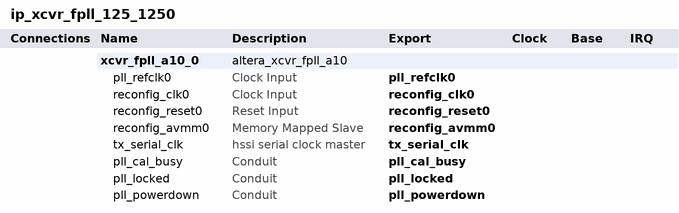
[diagram p0: system contents]
# Platform Designer (Qsys) system ip_xcvr_fpll_125_1250, Arria 10 10AX115N2F45E1SG
# Parameters at their usual value, and those the tool derives, are not listed.
package require -exact qsys 18.1
create_system ip_xcvr_fpll_125_1250
set_project_property DEVICE_FAMILY {Arria 10}
set_project_property DEVICE 10AX115N2F45E1SG

add_instance xcvr_fpll_a10_0 altera_xcvr_fpll_a10 18.1
set_instance_property xcvr_fpll_a10_0 AUTO_EXPORT true
set_instance_parameter_value xcvr_fpll_a10_0 base_device NIGHTFURY5
set_instance_parameter_value xcvr_fpll_a10_0 enable_analog_resets 0
set_instance_parameter_value xcvr_fpll_a10_0 enable_bonding_clks 0
set_instance_parameter_value xcvr_fpll_a10_0 enable_ext_lockdetect_ports 0
set_instance_parameter_value xcvr_fpll_a10_0 enable_fb_comp_bonding 0
set_instance_parameter_value xcvr_fpll_a10_0 enable_hfreq_clk 0
set_instance_parameter_value xcvr_fpll_a10_0 enable_mcgb 0
set_instance_parameter_value xcvr_fpll_a10_0 enable_mcgb_pcie_clksw 0
set_instance_parameter_value xcvr_fpll_a10_0 enable_pld_mcgb_cal_busy_port 0
set_instance_parameter_value xcvr_fpll_a10_0 enable_pll_reconfig 1
set_instance_parameter_value xcvr_fpll_a10_0 generate_add_hdl_instance_example 0
set_instance_parameter_value xcvr_fpll_a10_0 generate_docs 0
set_instance_parameter_value xcvr_fpll_a10_0 gui_actual_outclk0_frequency 100.0
set_instance_parameter_value xcvr_fpll_a10_0 gui_actual_outclk1_frequency 100.0
set_instance_parameter_value xcvr_fpll_a10_0 gui_actual_outclk2_frequency 100.0
set_instance_parameter_value xcvr_fpll_a10_0 gui_actual_outclk3_frequency 100.0
set_instance_parameter_value xcvr_fpll_a10_0 gui_actual_refclk_frequency 125.0
set_instance_parameter_value xcvr_fpll_a10_0 gui_bw_sel high
set_instance_parameter_value xcvr_fpll_a10_0 gui_cascade_outclk_index 0
set_instance_parameter_value xcvr_fpll_a10_0 gui_desired_hssi_cascade_frequency 100.0
set_instance_parameter_value xcvr_fpll_a10_0 gui_desired_outclk0_frequency 100.0
set_instance_parameter_value xcvr_fpll_a10_0 gui_desired_outclk1_frequency 100.0
set_instance_parameter_value xcvr_fpll_a10_0 gui_desired_outclk2_frequency 100.0
set_instance_parameter_value xcvr_fpll_a10_0 gui_desired_outclk3_frequency 100.0
set_instance_parameter_value xcvr_fpll_a10_0 gui_desired_refclk_frequency 125.0
set_instance_parameter_value xcvr_fpll_a10_0 gui_enable_50G_support false
set_instance_parameter_value xcvr_fpll_a10_0 gui_enable_active_clk false
set_instance_parameter_value xcvr_fpll_a10_0 gui_enable_cascade_out false
set_instance_parameter_value xcvr_fpll_a10_0 gui_enable_clk_bad false
set_instance_parameter_value xcvr_fpll_a10_0 gui_enable_dps false
set_instance_parameter_value xcvr_fpll_a10_0 gui_enable_fractional false
set_instance_parameter_value xcvr_fpll_a10_0 gui_enable_hip_cal_done_port 0
set_instance_parameter_value xcvr_fpll_a10_0 gui_enable_manual_config false
set_instance_parameter_value xcvr_fpll_a10_0 gui_enable_manual_hssi_counters false
set_instance_parameter_value xcvr_fpll_a10_0 gui_enable_phase_alignment false
set_instance_parameter_value xcvr_fpll_a10_0 gui_enable_pld_cal_busy_port 1
set_instance_parameter_value xcvr_fpll_a10_0 gui_fpll_mode 2
set_instance_parameter_value xcvr_fpll_a10_0 gui_fractional_x 32
set_instance_parameter_value xcvr_fpll_a10_0 gui_hip_cal_en 0
set_instance_parameter_value xcvr_fpll_a10_0 gui_hssi_output_clock_frequency 625.0
set_instance_parameter_value xcvr_fpll_a10_0 gui_hssi_prot_mode 0
set_instance_parameter_value xcvr_fpll_a10_0 gui_iqtxrxclk_outclk_index 0
set_instance_parameter_value xcvr_fpll_a10_0 gui_is_downstream_cascaded_pll false
set_instance_parameter_value xcvr_fpll_a10_0 gui_number_of_output_clocks 1
set_instance_parameter_value xcvr_fpll_a10_0 gui_operation_mode 0
set_instance_parameter_value xcvr_fpll_a10_0 gui_outclk0_actual_phase_shift 0.0
set_instance_parameter_value xcvr_fpll_a10_0 gui_outclk0_actual_phase_shift_deg 0.0
set_instance_parameter_value xcvr_fpll_a10_0 gui_outclk0_desired_phase_shift 0.0
set_instance_parameter_value xcvr_fpll_a10_0 gui_outclk0_phase_shift_unit 0
set_instance_parameter_value xcvr_fpll_a10_0 gui_outclk1_actual_phase_shift 0.0
set_instance_parameter_value xcvr_fpll_a10_0 gui_outclk1_actual_phase_shift_deg 0.0
set_instance_parameter_value xcvr_fpll_a10_0 gui_outclk1_desired_phase_shift 0
set_instance_parameter_value xcvr_fpll_a10_0 gui_outclk1_phase_shift_unit 0
set_instance_parameter_value xcvr_fpll_a10_0 gui_outclk2_actual_phase_shift {0 ps}
set_instance_parameter_value xcvr_fpll_a10_0 gui_outclk2_actual_phase_shift_deg {0 deg}
set_instance_parameter_value xcvr_fpll_a10_0 gui_outclk2_desired_phase_shift 0
set_instance_parameter_value xcvr_fpll_a10_0 gui_outclk2_phase_shift_unit 0
set_instance_parameter_value xcvr_fpll_a10_0 gui_outclk3_actual_phase_shift 0.0
set_instance_parameter_value xcvr_fpll_a10_0 gui_outclk3_actual_phase_shift_deg 0.0
set_instance_parameter_value xcvr_fpll_a10_0 gui_outclk3_desired_phase_shift 0
set_instance_parameter_value xcvr_fpll_a10_0 gui_outclk3_phase_shift_unit 0
set_instance_parameter_value xcvr_fpll_a10_0 gui_pll_c_counter_0 1
set_instance_parameter_value xcvr_fpll_a10_0 gui_pll_c_counter_1 1
set_instance_parameter_value xcvr_fpll_a10_0 gui_pll_c_counter_2 1
set_instance_parameter_value xcvr_fpll_a10_0 gui_pll_c_counter_3 1
set_instance_parameter_value xcvr_fpll_a10_0 gui_pll_dsm_fractional_division 1
set_instance_parameter_value xcvr_fpll_a10_0 gui_pll_m_counter 1
set_instance_parameter_value xcvr_fpll_a10_0 gui_pll_n_counter 1
set_instance_parameter_value xcvr_fpll_a10_0 gui_pll_set_hssi_k_counter 1
set_instance_parameter_value xcvr_fpll_a10_0 gui_pll_set_hssi_l_counter 1
set_instance_parameter_value xcvr_fpll_a10_0 gui_pll_set_hssi_m_counter 8
set_instance_parameter_value xcvr_fpll_a10_0 gui_pll_set_hssi_n_counter 1
set_instance_parameter_value xcvr_fpll_a10_0 gui_refclk1_frequency 100.0
set_instance_parameter_value xcvr_fpll_a10_0 gui_refclk_cnt 1
set_instance_parameter_value xcvr_fpll_a10_0 gui_refclk_index 0
set_instance_parameter_value xcvr_fpll_a10_0 gui_refclk_switch false
set_instance_parameter_value xcvr_fpll_a10_0 gui_reference_clock_frequency 100.0
set_instance_parameter_value xcvr_fpll_a10_0 gui_self_reset_enabled false
set_instance_parameter_value xcvr_fpll_a10_0 gui_switchover_delay 0
set_instance_parameter_value xcvr_fpll_a10_0 gui_switchover_mode {Automatic Switchover}
set_instance_parameter_value xcvr_fpll_a10_0 mcgb_aux_clkin_cnt 0
set_instance_parameter_value xcvr_fpll_a10_0 mcgb_div 1
set_instance_parameter_value xcvr_fpll_a10_0 phase_alignment_check_var false
set_instance_parameter_value xcvr_fpll_a10_0 pma_width 64
set_instance_parameter_value xcvr_fpll_a10_0 rcfg_debug 0
set_instance_parameter_value xcvr_fpll_a10_0 rcfg_enable_avmm_busy_port 0
set_instance_parameter_value xcvr_fpll_a10_0 rcfg_file_prefix altera_xcvr_fpll_a10
set_instance_parameter_value xcvr_fpll_a10_0 rcfg_h_file_enable 0
set_instance_parameter_value xcvr_fpll_a10_0 rcfg_jtag_enable 0
set_instance_parameter_value xcvr_fpll_a10_0 rcfg_mif_file_enable 0
set_instance_parameter_value xcvr_fpll_a10_0 rcfg_separate_avmm_busy 1
set_instance_parameter_value xcvr_fpll_a10_0 rcfg_sv_file_enable 0
set_instance_parameter_value xcvr_fpll_a10_0 rcfg_txt_file_enable 0
set_instance_parameter_value xcvr_fpll_a10_0 set_altera_xcvr_fpll_a10_calibration_en 1
set_instance_parameter_value xcvr_fpll_a10_0 set_capability_reg_enable 1
set_instance_parameter_value xcvr_fpll_a10_0 set_csr_soft_logic_enable 1
set_instance_parameter_value xcvr_fpll_a10_0 set_user_identifier 0
set_instance_parameter_value xcvr_fpll_a10_0 silicon_rev false
set_instance_parameter_value xcvr_fpll_a10_0 support_mode user_mode

# exported interfaces
add_interface pll_cal_busy conduit end
set_interface_property pll_cal_busy EXPORT_OF xcvr_fpll_a10_0.pll_cal_busy
add_interface pll_locked conduit end
set_interface_property pll_locked EXPORT_OF xcvr_fpll_a10_0.pll_locked
add_interface pll_powerdown conduit end
set_interface_property pll_powerdown EXPORT_OF xcvr_fpll_a10_0.pll_powerdown
add_interface pll_refclk0 clock sink
set_interface_property pll_refclk0 EXPORT_OF xcvr_fpll_a10_0.pll_refclk0
add_interface reconfig_avmm0 avalon slave
set_interface_property reconfig_avmm0 EXPORT_OF xcvr_fpll_a10_0.reconfig_avmm0
add_interface reconfig_clk0 clock sink
set_interface_property reconfig_clk0 EXPORT_OF xcvr_fpll_a10_0.reconfig_clk0
add_interface reconfig_reset0 reset sink
set_interface_property reconfig_reset0 EXPORT_OF xcvr_fpll_a10_0.reconfig_reset0
add_interface tx_serial_clk hssi_serial_clock start
set_interface_property tx_serial_clk EXPORT_OF xcvr_fpll_a10_0.tx_serial_clk

set_interconnect_requirement {$system} qsys_mm.clockCrossingAdapter HANDSHAKE
set_interconnect_requirement {$system} qsys_mm.enableEccProtection FALSE
set_interconnect_requirement {$system} qsys_mm.insertDefaultSlave FALSE
set_interconnect_requirement {$system} qsys_mm.maxAdditionalLatency 1

save_system ip_xcvr_fpll_125_1250.qsys
